# EAGLE schematic eCVT 507 (EAGLE 9.5.0)

## Sheet 1 of 4
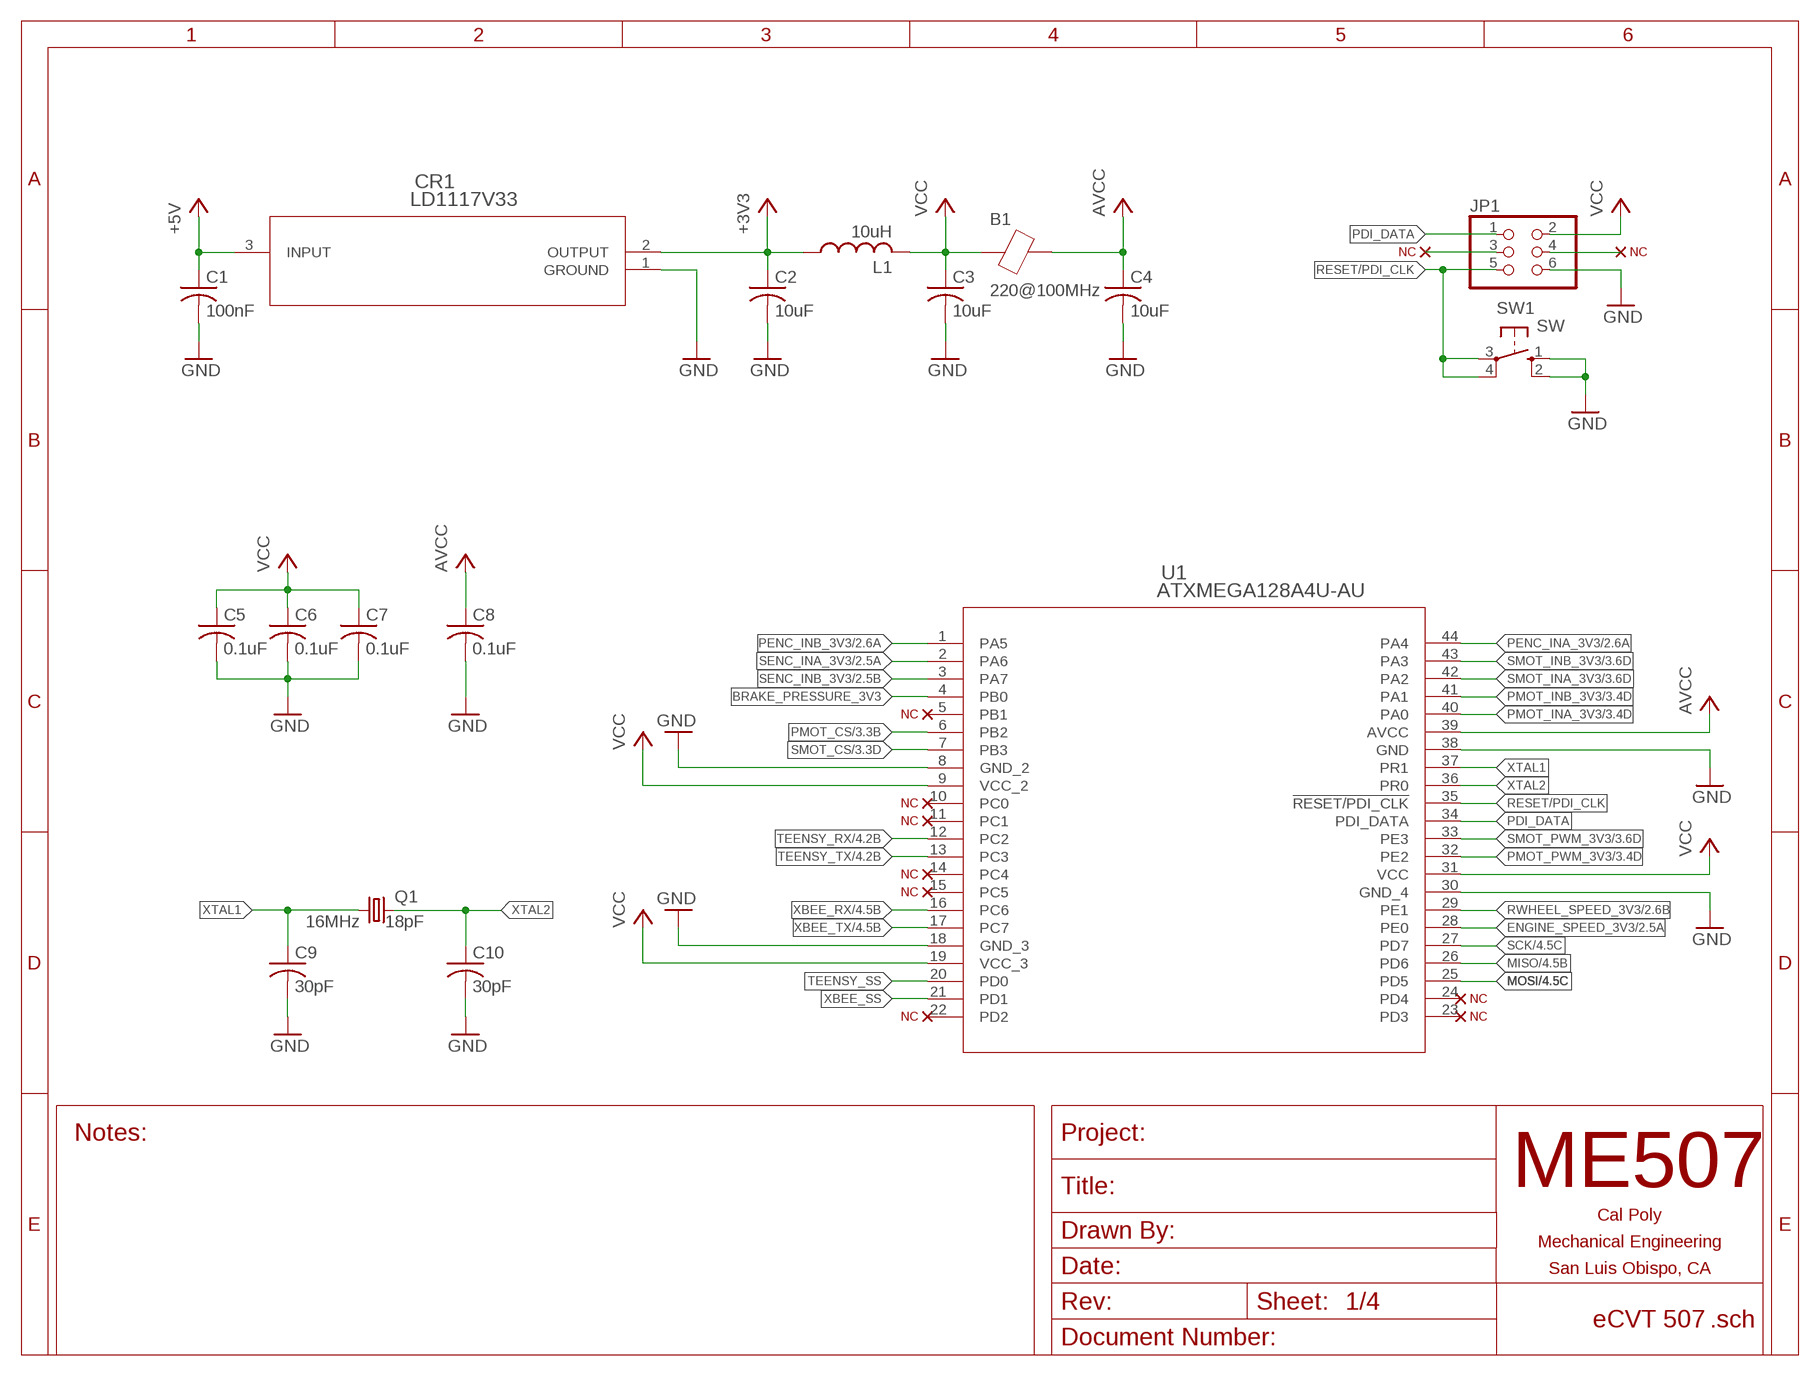
[diagram p0: schematic, sheet 1]

### Parts
B1  220@100MHz  BEAD0805  [0805]
C1  100nF  C-USC0805  [C0805]
C2  10uF  C-USC0805  [C0805]
C3  10uF  C-USC0805  [C0805]
C4  10uF  C-USC0805  [C0805]
C5  0.1uF  C-USC0805  [C0805]
C6  0.1uF  C-USC0805  [C0805]
C7  0.1uF  C-USC0805  [C0805]
C8  0.1uF  C-USC0805  [C0805]
C9  30pF  C-USC0805  [C0805]
C10  30pF  C-USC0805  [C0805]
CR1  LD1117V33  [TO-220]
JP1  PINHD-2X3  [2X03]
L1  10uH  L0805  [0805]
Q1  16MHz 18pF  CRYSTALHC49S  [HC49/S]
SW1  SW  [B3F-10XX]
U1  ATXMEGA128A4U-AU  [44A]
U$5  NC  (no package)
U$6  NC  (no package)
U$7  NC  (no package)
U$10  NC  (no package)
U$11  NC  (no package)
U$12  NC  (no package)
U$13  NC  (no package)
U$16  NC  (no package)
U$17  NC  (no package)
U$25  NC  (no package)

### Nets
+3V3: C2.1 CR1.2(OUTPUT) L1.1 ; also sheet 2,3,4
+5V: C1.1 CR1.3(INPUT) ; also sheet 2,3,4
AVCC: B1.2 C4.1 C8.1 U1.39(AVCC)
BRAKE_PRESSURE_3V3: U1.4(PB0)
ENGINE_SPEED_3V3: U1.28(PE0) ; also sheet 2
GND: C1.2 C2.2 C3.2 C4.2 C5.2 C6.2 C7.2 C8.2 C9.2 C10.2 CR1.1(GROUND) JP1.6 SW1.1(S) SW1.2(S1) U1.8(GND_2) U1.18(GND_3) U1.30(GND_4) U1.38(GND) ; also sheet 2,3,4
MISO: U1.26(PD6) ; also sheet 4
MOSI: U1.25(PD5) ; also sheet 4
N$1: U1.22(PD2) U$5.D
N$2: U1.14(PC4) U$10.D
N$3: U1.15(PC5) U$11.D
N$7: JP1.3 U$17.D
N$14: JP1.4 U$16.D
N$23: U1.24(PD4) U$12.D
N$26: U1.5(PB1) U$7.D
N$45: U1.23(PD3) U$25.D
N$48: U1.10(PC0) U$6.D
N$128: U1.11(PC1) U$13.D
PDI_DATA: JP1.1 U1.34(PDI_DATA)
PENC_INA_3V3: U1.44(PA4) ; also sheet 2
PENC_INB_3V3: U1.1(PA5) ; also sheet 2
PMOT_CS: U1.6(PB2) ; also sheet 3
PMOT_INA_3V3: U1.40(PA0) ; also sheet 3
PMOT_INB_3V3: U1.41(PA1) ; also sheet 3
PMOT_PWM_3V3: U1.32(PE2) ; also sheet 3
RESET/PDI_CLK: JP1.5 SW1.3(P) SW1.4(P1) U1.35(!RESET/PDI_CLK)
RWHEEL_SPEED_3V3: U1.29(PE1) ; also sheet 2
SCK: U1.27(PD7) ; also sheet 4
SENC_INA_3V3: U1.2(PA6) ; also sheet 2
SENC_INB_3V3: U1.3(PA7) ; also sheet 2
SMOT_CS: U1.7(PB3) ; also sheet 3
SMOT_INA_3V3: U1.42(PA2) ; also sheet 3
SMOT_INB_3V3: U1.43(PA3) ; also sheet 3
SMOT_PWM_3V3: U1.33(PE3) ; also sheet 3
TEENSY_RX: U1.12(PC2) ; also sheet 4
TEENSY_SS: U1.20(PD0)
TEENSY_TX: U1.13(PC3) ; also sheet 4
VCC: B1.1 C3.1 C5.1 C6.1 C7.1 JP1.2 L1.2 U1.9(VCC_2) U1.19(VCC_3) U1.31(VCC) ; also sheet 3
XBEE_RX: U1.16(PC6) ; also sheet 4
XBEE_SS: U1.21(PD1)
XBEE_TX: U1.17(PC7) ; also sheet 4
XTAL1: C9.1 Q1.1 U1.37(PR1)
XTAL2: C10.1 Q1.2 U1.36(PR0)

## Sheet 2 of 4
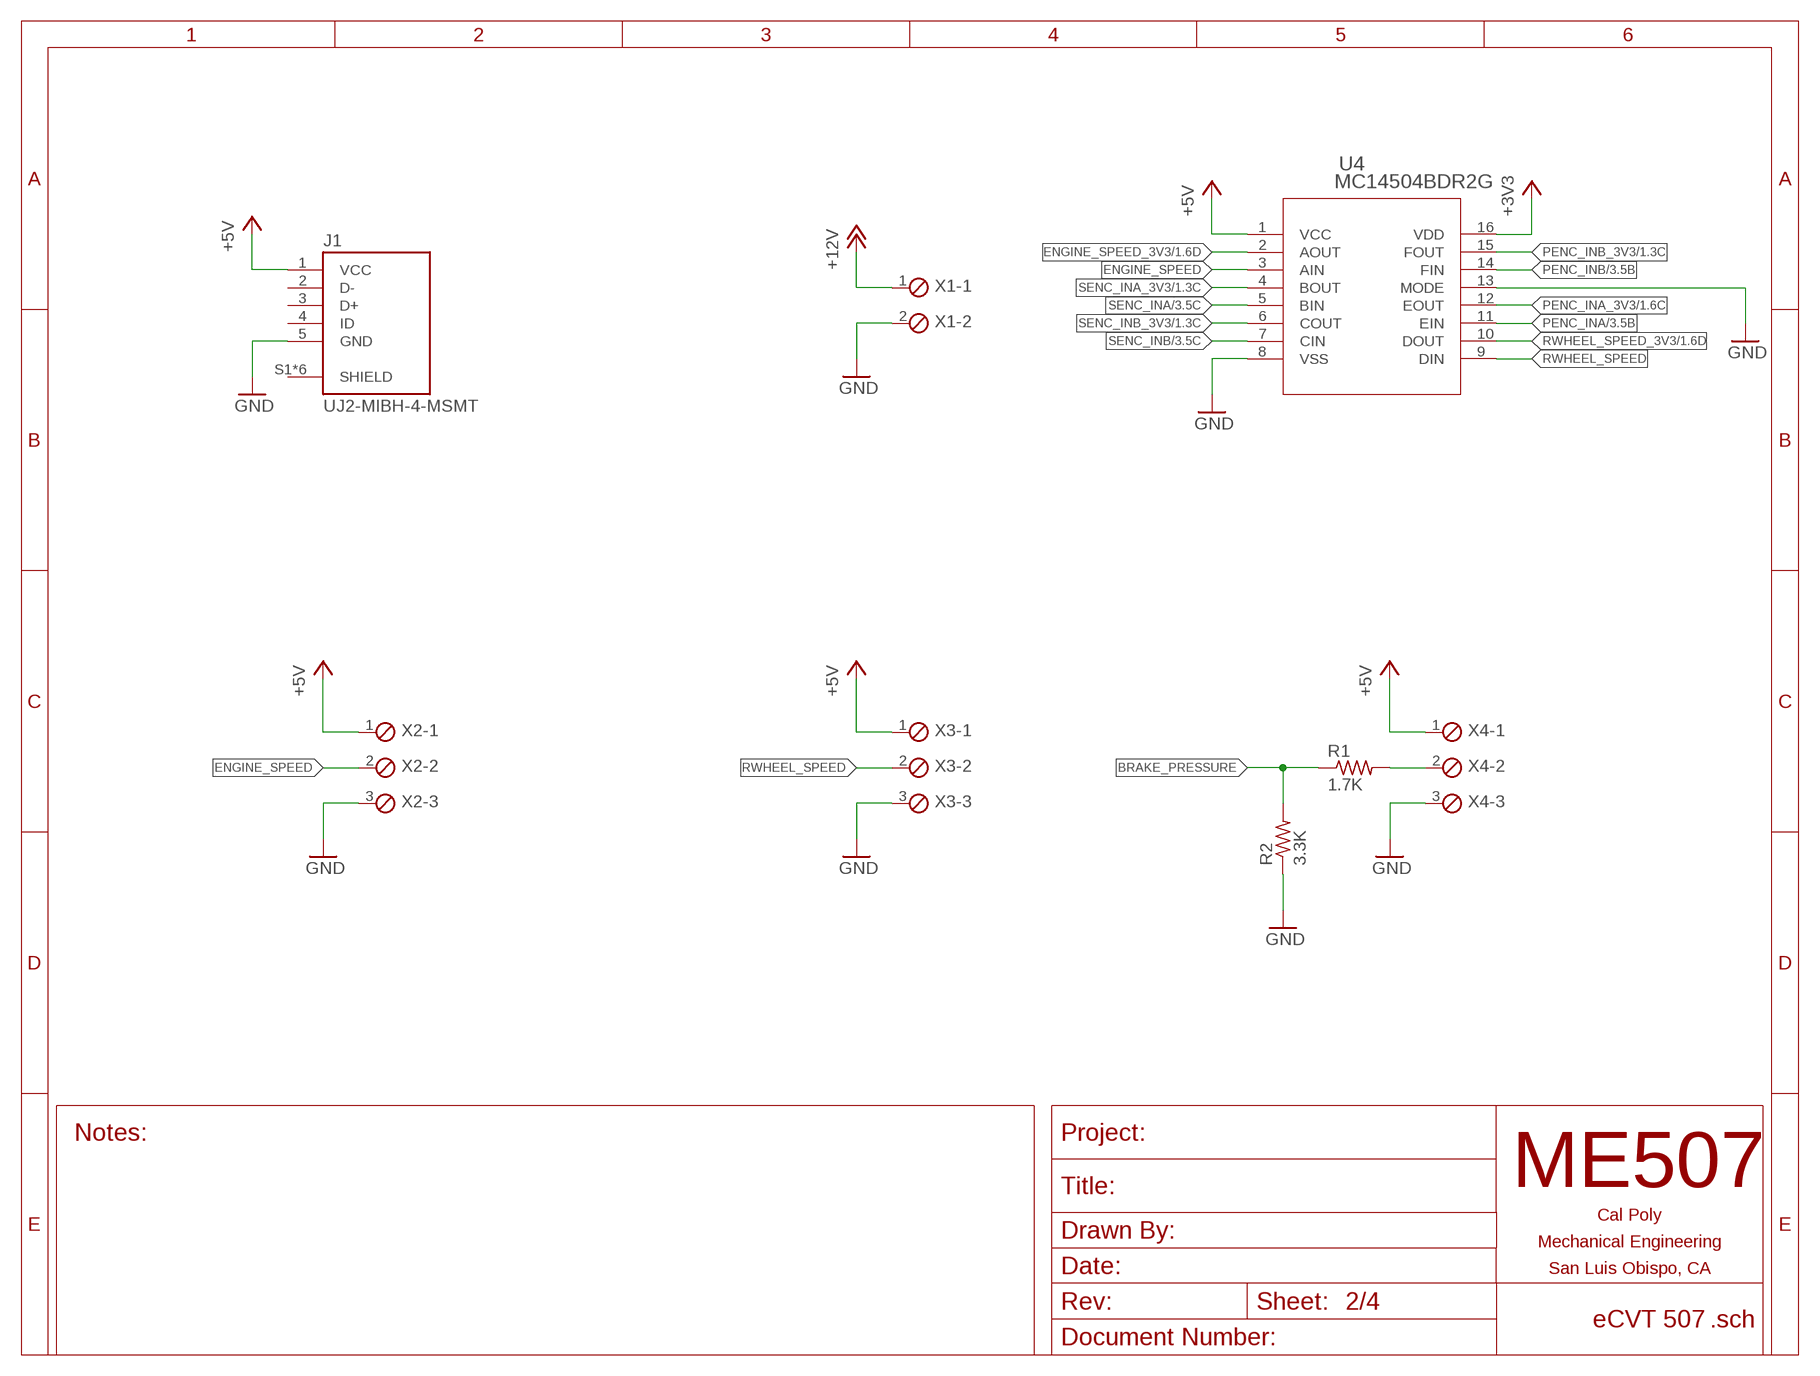
[diagram p1: schematic, sheet 2]

### Parts
J1  UJ2-MIBH-4-MSMT  [CUI_UJ2-MIBH-4-MSMT]
R1  1.7K  R-US_R0805  [R0805]
R2  3.3K  R-US_R0805  [R0805]
U4  MC14504BDR2G  [SOIC-16]
X1  SCREWTERM_2P_381  [2POL381]
X2  SCREWTERM_3P_381  [3POL381]
X3  SCREWTERM_3P_381  [3POL381]
X4  SCREWTERM_3P_381  [3POL381]

### Nets
+3V3: U4.16(VDD) ; also sheet 1,3,4
+5V: J1.1(VCC) U4.1(VCC) X2.1 X3.1 X4.1 ; also sheet 1,3,4
+12V: X1.1 ; also sheet 3
BRAKE_PRESSURE: R1.1 R2.2
ENGINE_SPEED: U4.3(AIN) X2.2
ENGINE_SPEED_3V3: U4.2(AOUT) ; also sheet 1
GND: J1.5(GND) R2.1 U4.8(VSS) U4.13(MODE) X1.2 X2.3 X3.3 X4.3 ; also sheet 1,3,4
N$39: R1.2 X4.2
PENC_INA: U4.11(EIN) ; also sheet 3
PENC_INA_3V3: U4.12(EOUT) ; also sheet 1
PENC_INB: U4.14(FIN) ; also sheet 3
PENC_INB_3V3: U4.15(FOUT) ; also sheet 1
RWHEEL_SPEED: U4.9(DIN) X3.2
RWHEEL_SPEED_3V3: U4.10(DOUT) ; also sheet 1
SENC_INA: U4.5(BIN) ; also sheet 3
SENC_INA_3V3: U4.4(BOUT) ; also sheet 1
SENC_INB: U4.7(CIN) ; also sheet 3
SENC_INB_3V3: U4.6(COUT) ; also sheet 1
Unconnected: J1.2(D-) J1.3(D+) J1.4(ID) J1.S1(SHIELD) J1.S2(SHIELD) J1.S3(SHIELD) J1.S4(SHIELD) J1.S5(SHIELD) J1.S6(SHIELD)

## Sheet 3 of 4
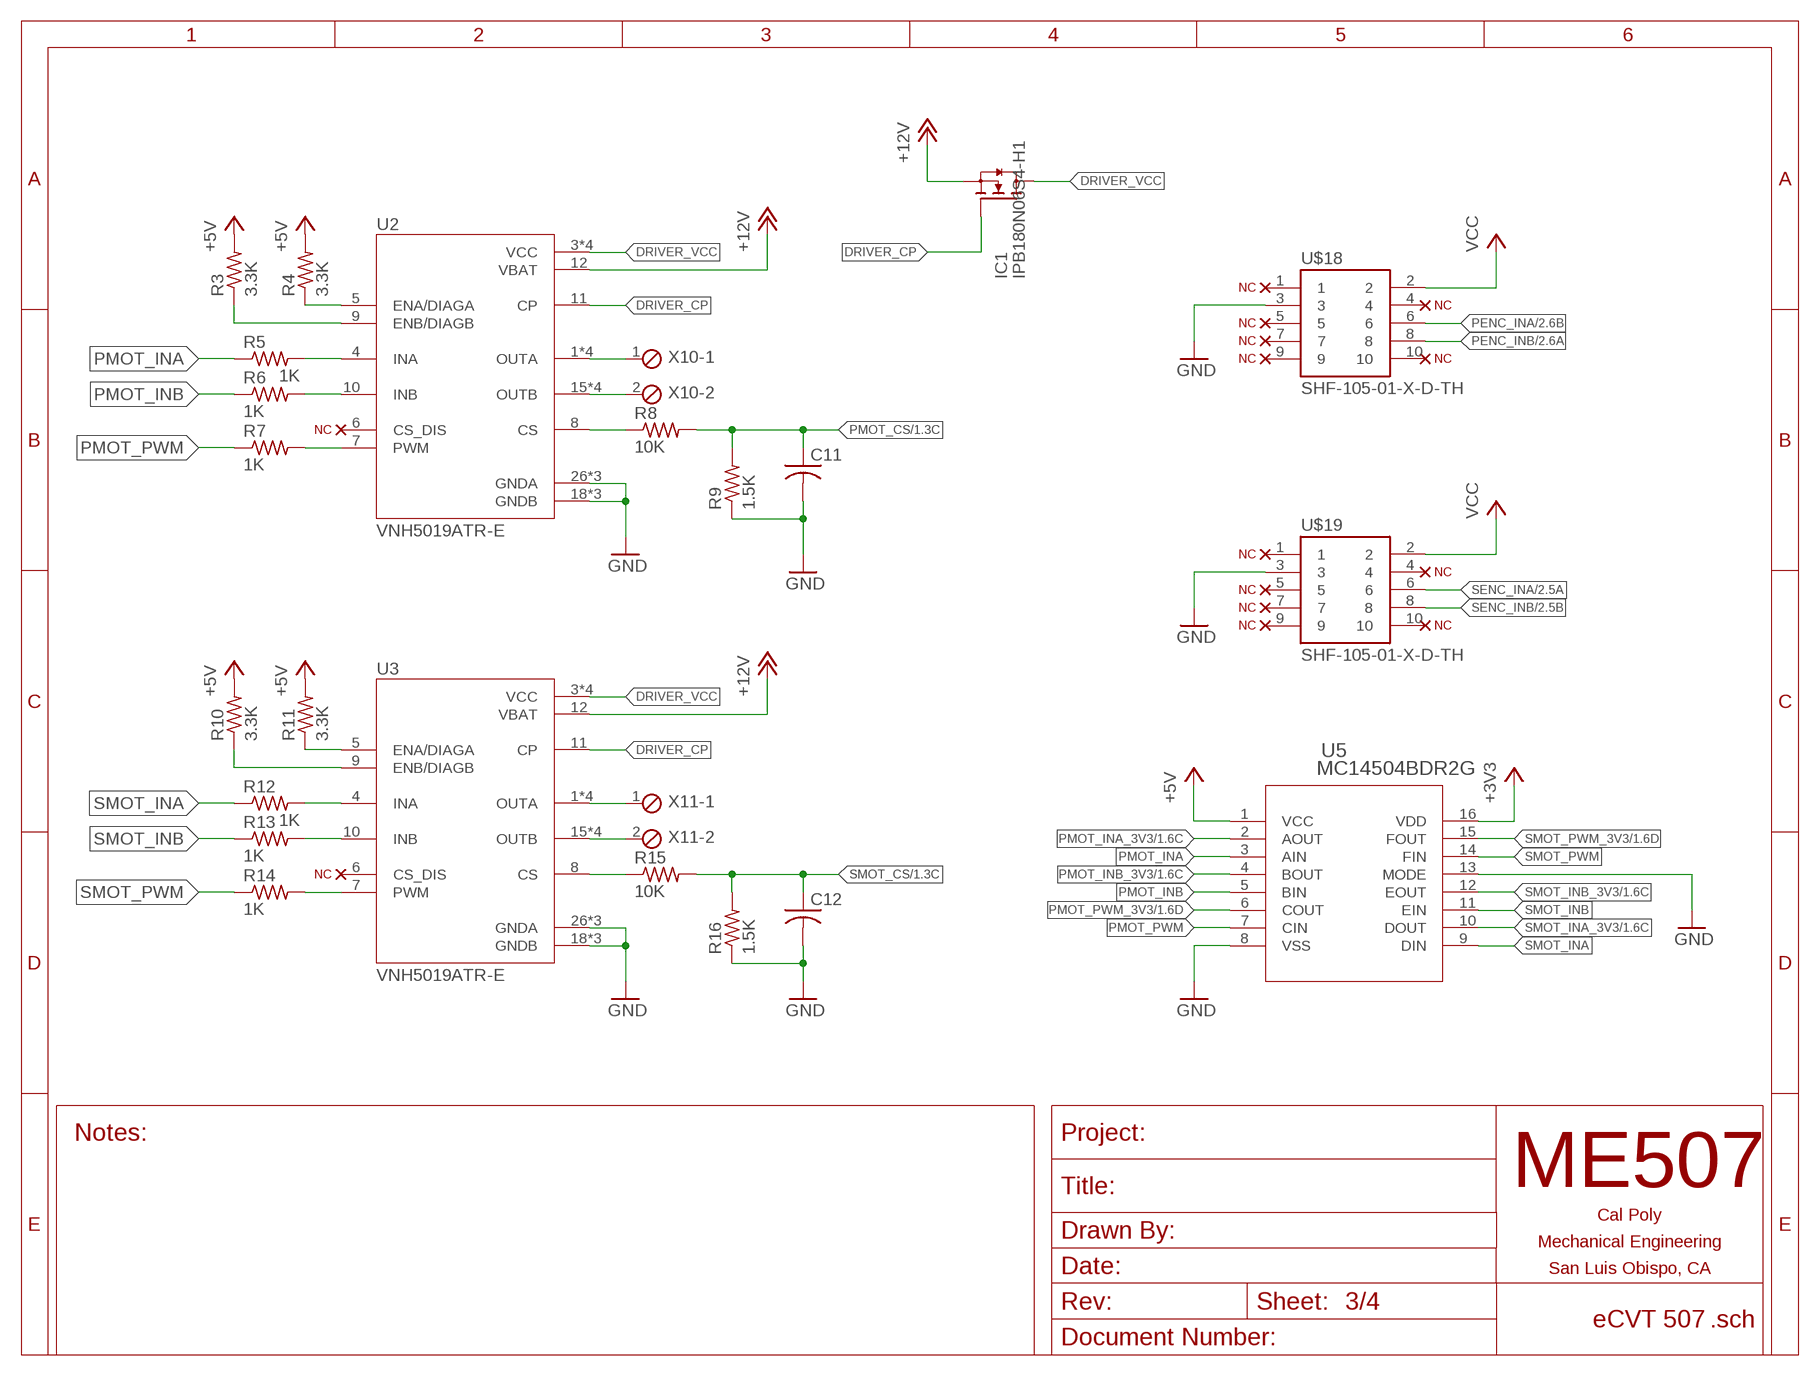
[diagram p2: schematic, sheet 3]

### Parts
C11  C-USC0805  [C0805]
C12  C-USC0805  [C0805]
IC1  IPB180N06S4-H1  [PG-TO263-7-3]
R3  3.3K  R-US_R0805  [R0805]
R4  3.3K  R-US_R0805  [R0805]
R5  1K  R-US_R0805  [R0805]
R6  1K  R-US_R0805  [R0805]
R7  1K  R-US_R0805  [R0805]
R8  10K  R-US_R0805  [R0805]
R9  1.5K  R-US_R0805  [R0805]
R10  3.3K  R-US_R0805  [R0805]
R11  3.3K  R-US_R0805  [R0805]
R12  1K  R-US_R0805  [R0805]
R13  1K  R-US_R0805  [R0805]
R14  1K  R-US_R0805  [R0805]
R15  10K  R-US_R0805  [R0805]
R16  1.5K  R-US_R0805  [R0805]
U2  VNH5019ATR-E  [IC_VNH5019ATR-E]
U3  VNH5019ATR-E  [IC_VNH5019ATR-E]
U5  MC14504BDR2G  [SOIC-16]
U$18  SHF-105-01-X-D-TH  [SHF-105-01-X-D-TH]
U$19  SHF-105-01-X-D-TH  [SHF-105-01-X-D-TH]
U$31  NC  (no package)
U$33  NC  (no package)
U$58  NC  (no package)
U$59  NC  (no package)
U$60  NC  (no package)
U$61  NC  (no package)
U$62  NC  (no package)
U$63  NC  (no package)
U$64  NC  (no package)
U$65  NC  (no package)
U$66  NC  (no package)
U$67  NC  (no package)
U$68  NC  (no package)
U$69  NC  (no package)
X10  SCREWTERM_2P_381  [2POL381]
X11  SCREWTERM_2P_381  [2POL381]

### Nets
+3V3: U5.16(VDD) ; also sheet 1,2,4
+5V: R3.2 R4.2 R10.2 R11.2 U5.1(VCC) ; also sheet 1,2,4
+12V: IC1.2(S) IC1.3(S) IC1.5(S) IC1.6(S) IC1.7(S) U2.12(VBAT) U3.12(VBAT) ; also sheet 2
DRIVER_CP: IC1.1(G) U2.11(CP) U3.11(CP)
DRIVER_VCC: IC1.8(D) U2.3(VCC) U2.13(VCC) U2.23(VCC) U2.HS1(VCC) U3.3(VCC) U3.13(VCC) U3.23(VCC) U3.HS1(VCC)
GND: C11.2 C12.2 R9.1 R16.1 U2.18(GNDB) U2.19(GNDB) U2.20(GNDB) U2.26(GNDA) U2.27(GNDA) U2.28(GNDA) U3.18(GNDB) U3.19(GNDB) U3.20(GNDB) U3.26(GNDA) U3.27(GNDA) U3.28(GNDA) U5.8(VSS) U5.13(MODE) U$18.3 U$19.3 ; also sheet 1,2,4
N$4: R11.1 U3.5(ENA/DIAGA)
N$5: R5.2 U2.4(INA)
N$6: R10.1 U3.9(ENB/DIAGB)
N$10: R4.1 U2.5(ENA/DIAGA)
N$12: R6.2 U2.10(INB)
N$13: R8.1 U2.8(CS)
N$16: U2.15(OUTB) U2.16(OUTB) U2.21(OUTB) U2.HS3(OUTB) X10.2
N$17: U2.1(OUTA) U2.25(OUTA) U2.30(OUTA) U2.HS2(OUTA) X10.1
N$18: R3.1 U2.9(ENB/DIAGB)
N$19: R7.2 U2.7(PWM)
N$28: R12.2 U3.4(INA)
N$29: R13.2 U3.10(INB)
N$30: R14.2 U3.7(PWM)
N$31: R15.1 U3.8(CS)
N$33: U3.15(OUTB) U3.16(OUTB) U3.21(OUTB) U3.HS3(OUTB) X11.2
N$34: U3.1(OUTA) U3.25(OUTA) U3.30(OUTA) U3.HS2(OUTA) X11.1
N$37: U$18.1 U$58.D
N$38: U$19.1 U$59.D
N$46: U2.6(CS_DIS) U$31.D
N$77: U$18.5 U$60.D
N$78: U$18.7 U$61.D
N$79: U$18.9 U$62.D
N$80: U$18.4 U$63.D
N$81: U$18.10 U$64.D
N$82: U$19.5 U$65.D
N$83: U$19.7 U$66.D
N$84: U$19.9 U$67.D
N$85: U$19.4 U$68.D
N$86: U$19.10 U$69.D
N$133: U3.6(CS_DIS) U$33.D
PENC_INA: U$18.6 ; also sheet 2
PENC_INB: U$18.8 ; also sheet 2
PMOT_CS: C11.1 R8.2 R9.2 ; also sheet 1
PMOT_INA: R5.1 U5.3(AIN)
PMOT_INA_3V3: U5.2(AOUT) ; also sheet 1
PMOT_INB: R6.1 U5.5(BIN)
PMOT_INB_3V3: U5.4(BOUT) ; also sheet 1
PMOT_PWM: R7.1 U5.7(CIN)
PMOT_PWM_3V3: U5.6(COUT) ; also sheet 1
SENC_INA: U$19.6 ; also sheet 2
SENC_INB: U$19.8 ; also sheet 2
SMOT_CS: C12.1 R15.2 R16.2 ; also sheet 1
SMOT_INA: R12.1 U5.9(DIN)
SMOT_INA_3V3: U5.10(DOUT) ; also sheet 1
SMOT_INB: R13.1 U5.11(EIN)
SMOT_INB_3V3: U5.12(EOUT) ; also sheet 1
SMOT_PWM: R14.1 U5.14(FIN)
SMOT_PWM_3V3: U5.15(FOUT) ; also sheet 1
VCC: U$18.2 U$19.2 ; also sheet 1

## Sheet 4 of 4
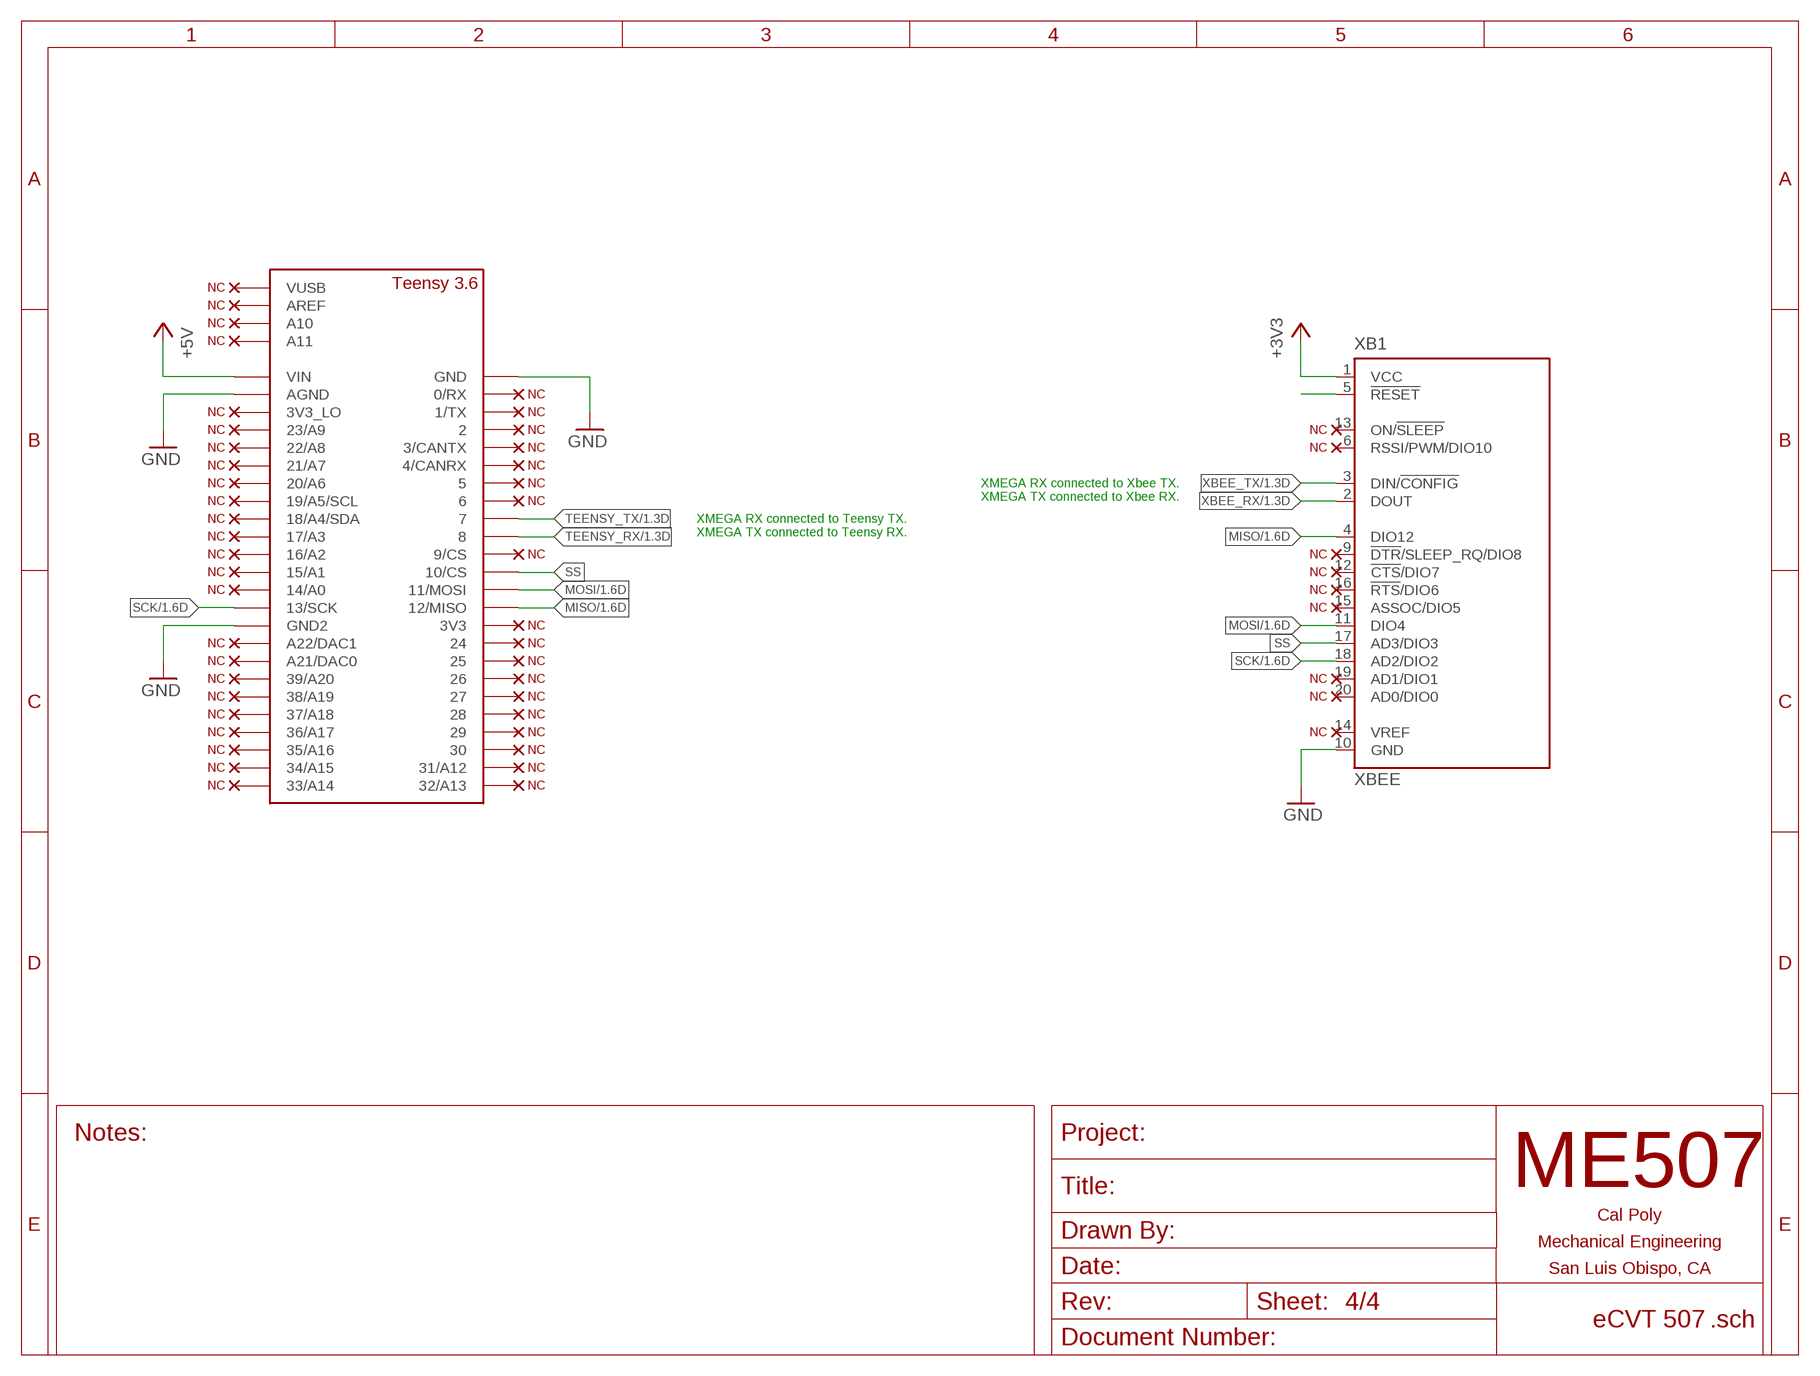
[diagram p3: schematic, sheet 4]

### Parts
U$1  NC  (no package)
U$2  NC  (no package)
U$3  TEENSY_3.5/3.6_BASIC  [TEENSY_3.5/3.6_BASIC]
U$4  NC  (no package)
U$20  NC  (no package)
U$21  NC  (no package)
U$22  NC  (no package)
U$23  NC  (no package)
U$24  NC  (no package)
U$27  NC  (no package)
U$29  NC  (no package)
U$70  NC  (no package)
U$71  NC  (no package)
U$72  NC  (no package)
U$73  NC  (no package)
U$74  NC  (no package)
U$75  NC  (no package)
U$76  NC  (no package)
U$77  NC  (no package)
U$78  NC  (no package)
U$79  NC  (no package)
U$80  NC  (no package)
U$81  NC  (no package)
U$82  NC  (no package)
U$83  NC  (no package)
U$84  NC  (no package)
U$85  NC  (no package)
U$86  NC  (no package)
U$87  NC  (no package)
U$88  NC  (no package)
U$89  NC  (no package)
U$90  NC  (no package)
U$91  NC  (no package)
U$92  NC  (no package)
U$93  NC  (no package)
U$94  NC  (no package)
U$95  NC  (no package)
U$98  NC  (no package)
U$99  NC  (no package)
U$100  NC  (no package)
U$101  NC  (no package)
U$102  NC  (no package)
U$103  NC  (no package)
U$104  NC  (no package)
U$105  NC  (no package)
U$106  NC  (no package)
U$107  NC  (no package)
U$108  NC  (no package)
U$113  NC  (no package)
U$114  NC  (no package)
U$115  NC  (no package)
U$116  NC  (no package)
XB1  XBEE  [XBEE]

### Nets
+3V3: XB1.1(VCC) ; also sheet 1,2,3
+5V: U$3.VIN ; also sheet 1,2,3
GND: U$3.AGND U$3.GND U$3.GND2 XB1.10(GND) ; also sheet 1,2,3
MISO: U$3.12/MISO XB1.4(DIO12) ; also sheet 1
MOSI: U$3.11/MOSI XB1.11(DIO4) ; also sheet 1
N$8: U$3.0/RX U$70.D
N$9: U$3.1/TX U$4.D
N$11: XB1.5(!RESET)
N$20: U$1.D XB1.6(RSSI/PWM/DIO10)
N$21: U$2.D XB1.9(!DTR!/SLEEP_RQ/DIO8)
N$40: U$20.D XB1.14(VREF)
N$41: U$21.D XB1.12(!CTS!/DIO7)
N$42: U$22.D XB1.13(ON/!SLEEP)
N$43: U$23.D XB1.15(ASSOC/DIO5)
N$44: U$24.D XB1.16(!RTS!/DIO6)
N$47: U$27.D XB1.19(AD1/DIO1)
N$50: U$29.D XB1.20(AD0/DIO0)
N$87: U$3.2 U$71.D
N$88: U$3.3/CANTX U$72.D
N$89: U$3.4/CANRX U$73.D
N$90: U$3.5 U$74.D
N$91: U$3.6 U$75.D
N$92: U$3.9/CS U$76.D
N$93: U$3.3V3 U$77.D
N$94: U$3.24 U$78.D
N$95: U$3.25 U$79.D
N$96: U$3.26 U$80.D
N$97: U$3.27 U$81.D
N$98: U$3.28 U$82.D
N$99: U$3.29 U$83.D
N$100: U$3.30 U$84.D
N$101: U$3.31/A12 U$85.D
N$102: U$3.32/A13 U$86.D
N$103: U$3.33/A14 U$87.D
N$104: U$3.34/A15 U$88.D
N$105: U$3.35/A16 U$89.D
N$106: U$3.36/A17 U$90.D
N$107: U$3.37/A18 U$91.D
N$108: U$3.38/A19 U$92.D
N$109: U$3.39/A20 U$93.D
N$110: U$3.21/DAC0(A21/DAC0) U$94.D
N$111: U$3.A22/DAC1 U$95.D
N$114: U$3.14/A0 U$98.D
N$115: U$3.15/A1 U$99.D
N$116: U$3.16/A2 U$100.D
N$117: U$3.17/A3 U$101.D
N$118: U$3.18/A4/SDA U$102.D
N$119: U$3.19/A5/SCL U$103.D
N$120: U$3.20/A6 U$104.D
N$121: U$3.21/A7 U$105.D
N$122: U$3.22/A8 U$106.D
N$123: U$3.23/A9 U$107.D
N$124: U$3.3V3_LO U$108.D
N$129: U$3.A11 U$113.D
N$130: U$3.A10 U$114.D
N$131: U$3.AREF U$115.D
N$132: U$3.VUSB U$116.D
SCK: U$3.13/SCK XB1.18(AD2/DIO2) ; also sheet 1
SS: U$3.10/CS XB1.17(AD3/DIO3)
TEENSY_RX: U$3.8 ; also sheet 1
TEENSY_TX: U$3.7 ; also sheet 1
XBEE_RX: XB1.2(DOUT) ; also sheet 1
XBEE_TX: XB1.3(DIN/!CONFIG) ; also sheet 1

### Notes on the sheet
- XMEGA RX connected to Xbee TX.
  XMEGA TX connected to Xbee RX.
- XMEGA RX connected to Teensy TX.
  XMEGA TX connected to Teensy RX.

## Library data of the parts
B1 = ME507:BEAD: Ferrite Bead
C1-C12 = rcl:C-US: CAPACITOR, American symbol; SPICEPREFIX: C
CR1 = LD1117V33:LD1117V33; MANUFACTURER_PART_NUMBER: LD1117V33; VENDOR: STMicroelectronics
IC1 = infineon:IPB180N06S4-H1: OptiMOS®-T2 Power-Transistor Source: 1859075.pdf (Farnell)
J1 = UJ2-MIBH-4-MSMT:UJ2-MIBH-4-MSMT: Micro B, USB 2.0, 1.8 A, Right Angle, Mid-Mount SMT, USB Receptacle; CUI_PURCHASE_URL: https://www.cuidevices.com/product/interconnect/connectors/usb-connectors/uj2-mibh-4-msmt?utm_source=snapeda.com&utm_medium=referral&utm_campaign=snapedaBOM; DESCRIPTION: Micro B, USB 2.0, 1.8 A, Right Angle, Mid Mount _SMT_, USB Receptacle; DIGI-KEY_PART_NUMBER: 102-4008-1-ND; DIGI-KEY_PURCHASE_URL: https://www.digikey.com/product-detail/en/cui-devices/UJ2-MIBH-4-MSMT-TR/102-4008-1-ND/6187930?utm_source=snapeda&utm_medium=aggregator&utm_campaign=symbol; MF: CUI Devices; MP: UJ2-MIBH-4-MSMT-TR; PACKAGE: None
JP1 = pinhead:PINHD-2X3: PIN HEADER
L1 = ME507:L
Q1 = crystal:CRYSTAL: CRYSTAL; OC_FARNELL: 1667008; OC_NEWARK: unknown
R1-R16 = rcl:R-US_: RESISTOR, American symbol; SPICEPREFIX: R
SW1 = ME507:SW: OMRON SWITCH; MPN: B3F-1000; OC_FARNELL: 176432; OC_NEWARK: 36M3542
U1 = XMEGA:ATXMEGA128A4U-AU; MANUFACTURER_PART_NUMBER: ATXMEGA128A4UAU; VENDOR: Atmel
U2 U3 = VNH5019ATR-E:VNH5019ATR-E: Motor / Motion / Ignition Controllers & Drivers Automotive h-Bridge 18mohm 30a 41v Vcc; DESCRIPTION: Motor / Motion / Ignition Controllers & Drivers Automotive h-Bridge 18mohm 30a 41v Vcc; DIGI-KEY_PART_NUMBER: 497-13073-1-ND; DIGI-KEY_PURCHASE_URL: https://www.digikey.com/product-detail/en/stmicroelectronics/VNH5019ATR-E/497-13073-1-ND/3455763?utm_source=snapeda&utm_medium=aggregator&utm_campaign=symbol; MF: STMicroelectronics; MP: VNH5019ATR-E; PACKAGE: SOP-30 STMicroelectronics
U4 U5 = MC14504BDR2G:MC14504BDR2G; MANUFACTURER_PART_NUMBER: MC14504BDR2G; VENDOR: ON Semiconductor
U$1 U$2 U$4-U$7 U$10-U$13 U$16 U$17 U$20-U$25 U$27 U$29 U$31 U$33 U$58-U$95 U$98-U$108 U$113-U$116 = ME507:NC
U$3 = Teensy356:TEENSY_3.5/3.6_BASIC
U$18 U$19 = SHF-105-01-X-D-TH:SHF-105-01-X-D-TH: .050 x .050 SHROUDED TERMINAL STRIP.; DESCRIPTION: SHF Series .050 Shrouded Terminal Strip For FFSD; DIGI-KEY_PART_NUMBER: SAM10711-ND; DIGI-KEY_PURCHASE_URL: https://www.digikey.com/product-detail/en/samtec-inc/SHF-105-01-L-D-TH/SAM10711-ND/6561671?utm_source=snapeda&utm_medium=aggregator&utm_campaign=symbol; MF: Samtec; MP: SHF-105-01-L-D-TH; PACKAGE: None
X1 X10 X11 = ME507:SCREWTERM_2P: PHOENIX CONNECTOR
X2-X4 = ME507:SCREWTERM_3P: PHOENIX CONNECTOR
XB1 = xbee:XBEE: XBee (TM) /XBee-PRO(TM) OEM RF Modules Source: MaxStream, Inc. xbee_productmanual.pdf; MPN: XBP24-Z7UIT-004; OC_FARNELL: 1751799; OC_NEWARK: 34R5507